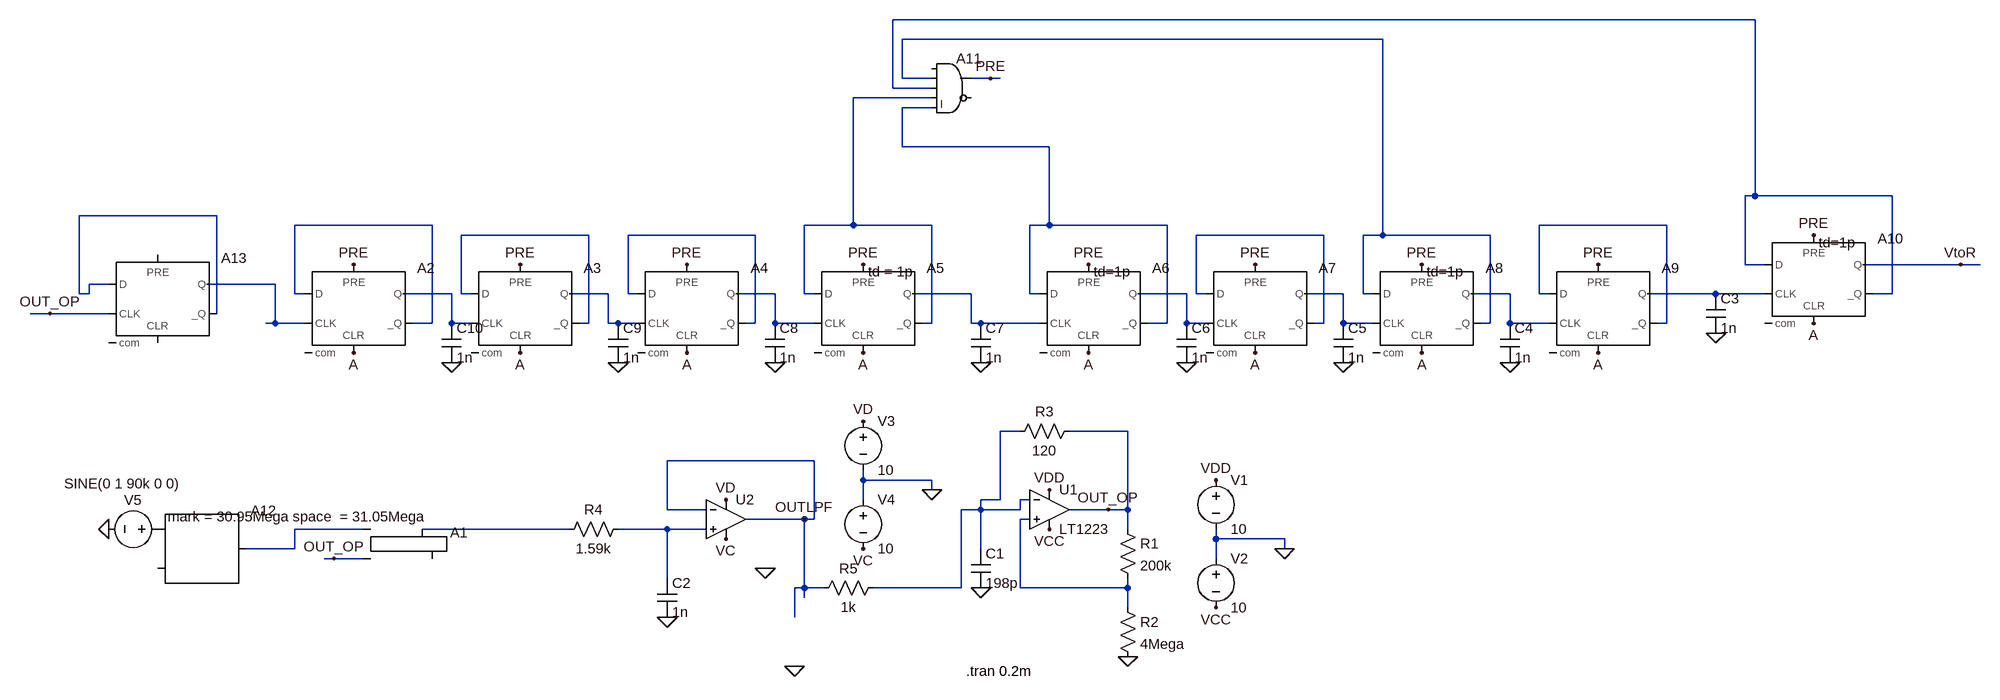
[diagram p0: schematic PLL-Yoav.asc]
PLL-Yoav.asc, the LTspice schematic file:
Version 4
SHEET 1 2084 812
WIRE 1328 -656 -80 -656
WIRE 720 -624 -64 -624
WIRE -64 -560 -64 -624
WIRE -16 -560 -64 -560
WIRE 80 -560 48 -560
WIRE 96 -560 80 -560
WIRE -80 -544 -80 -656
WIRE -16 -544 -80 -544
WIRE -16 -528 -144 -528
WIRE -16 -512 -64 -512
WIRE -64 -448 -64 -512
WIRE 176 -448 -64 -448
WIRE 1328 -368 1328 -656
WIRE 1328 -368 1312 -368
WIRE 1552 -368 1328 -368
WIRE -1184 -336 -1408 -336
WIRE -832 -320 -1056 -320
WIRE -144 -320 -144 -528
WIRE -144 -320 -224 -320
WIRE -16 -320 -144 -320
WIRE 176 -320 176 -448
WIRE 176 -320 144 -320
WIRE 368 -320 176 -320
WIRE 1184 -320 976 -320
WIRE -576 -304 -784 -304
WIRE -304 -304 -512 -304
WIRE 624 -304 416 -304
WIRE 720 -304 720 -624
WIRE 720 -304 688 -304
WIRE 896 -304 720 -304
WIRE 1312 -256 1312 -368
WIRE 1344 -256 1312 -256
WIRE 1664 -256 1504 -256
WIRE 1696 -256 1664 -256
WIRE -1360 -224 -1392 -224
WIRE -1088 -224 -1200 -224
WIRE -1408 -208 -1408 -336
WIRE -1392 -208 -1392 -224
WIRE -1392 -208 -1408 -208
WIRE -1056 -208 -1056 -320
WIRE -1040 -208 -1056 -208
WIRE -800 -208 -880 -208
WIRE -784 -208 -784 -304
WIRE -768 -208 -784 -208
WIRE -544 -208 -608 -208
WIRE -512 -208 -512 -304
WIRE -496 -208 -512 -208
WIRE -272 -208 -336 -208
WIRE -224 -208 -224 -320
WIRE -208 -208 -224 -208
WIRE 48 -208 -48 -208
WIRE 144 -208 144 -320
WIRE 160 -208 144 -208
WIRE 400 -208 320 -208
WIRE 416 -208 416 -304
WIRE 432 -208 416 -208
WIRE 656 -208 592 -208
WIRE 688 -208 688 -304
WIRE 704 -208 688 -208
WIRE 928 -208 864 -208
WIRE 976 -208 976 -320
WIRE 992 -208 976 -208
WIRE 1264 -208 1152 -208
WIRE 1344 -208 1264 -208
WIRE 1552 -208 1552 -368
WIRE 1552 -208 1520 -208
WIRE -1456 -176 -1488 -176
WIRE -1360 -176 -1456 -176
WIRE -1184 -176 -1184 -336
WIRE -1088 -160 -1088 -224
WIRE -1088 -160 -1104 -160
WIRE -1040 -160 -1088 -160
WIRE -832 -160 -832 -320
WIRE -832 -160 -864 -160
WIRE -800 -160 -800 -208
WIRE -768 -160 -800 -160
WIRE -576 -160 -576 -304
WIRE -576 -160 -592 -160
WIRE -544 -160 -544 -208
WIRE -528 -160 -544 -160
WIRE -496 -160 -528 -160
WIRE -304 -160 -304 -304
WIRE -304 -160 -320 -160
WIRE -272 -160 -272 -208
WIRE -208 -160 -272 -160
WIRE -16 -160 -16 -320
WIRE -16 -160 -32 -160
WIRE 48 -160 48 -208
WIRE 64 -160 48 -160
WIRE 160 -160 64 -160
WIRE 368 -160 368 -320
WIRE 368 -160 336 -160
WIRE 400 -160 400 -208
WIRE 432 -160 400 -160
WIRE 624 -160 624 -304
WIRE 624 -160 608 -160
WIRE 656 -160 656 -208
WIRE 704 -160 656 -160
WIRE 896 -160 896 -304
WIRE 896 -160 880 -160
WIRE 928 -160 928 -208
WIRE 992 -160 928 -160
WIRE 1184 -160 1184 -320
WIRE 1184 -160 1168 -160
WIRE 128 16 96 16
WIRE 304 16 208 16
WIRE -208 64 -448 64
WIRE -128 96 -128 80
WIRE -16 96 -128 96
WIRE -16 112 -16 96
WIRE -128 128 -128 96
WIRE 96 128 96 16
WIRE 96 128 64 128
WIRE 144 128 128 128
WIRE -448 144 -448 64
WIRE -384 144 -448 144
WIRE 64 144 64 128
WIRE 64 144 32 144
WIRE 128 144 128 128
WIRE 128 144 64 144
WIRE 272 144 208 144
WIRE 304 144 304 16
WIRE 304 144 272 144
WIRE -224 160 -320 160
WIRE -208 160 -208 64
WIRE -208 160 -224 160
WIRE 144 160 128 160
WIRE -944 176 -1056 176
WIRE -608 176 -848 176
WIRE -448 176 -528 176
WIRE -384 176 -448 176
WIRE 304 176 304 144
WIRE 448 192 448 176
WIRE 560 192 448 192
WIRE -1056 208 -1056 176
WIRE -1056 208 -1136 208
WIRE 64 208 64 144
WIRE 560 208 560 192
WIRE -992 224 -1008 224
WIRE -944 224 -992 224
WIRE 448 224 448 192
WIRE -448 256 -448 176
WIRE -224 272 -224 160
WIRE -224 272 -240 272
WIRE -192 272 -224 272
WIRE 32 272 32 144
WIRE 32 272 -112 272
WIRE 128 272 128 160
WIRE 304 272 304 256
WIRE 304 272 128 272
WIRE -224 288 -224 272
WIRE 304 304 304 272
WIRE -240 320 -240 272
FLAG 64 272 0
FLAG 560 208 0
FLAG 448 96 VDD
FLAG 448 304 VCC
FLAG 176 112 VDD
FLAG 176 176 VCC
FLAG 272 144 OUT_OP
FLAG -16 112 0
FLAG -128 0 VD
FLAG -128 208 VC
FLAG -448 320 0
FLAG -352 128 VD
FLAG -352 192 VC
FLAG -224 160 OUTLPF
FLAG -1360 176 0
FLAG 1264 -144 0
FLAG 1664 -256 VtoR
FLAG 1424 -304 PRE
FLAG 1072 -256 PRE
FLAG 784 -256 PRE
FLAG 512 -256 PRE
FLAG 240 -256 PRE
FLAG -128 -256 PRE
FLAG -416 -256 PRE
FLAG -688 -256 PRE
FLAG -960 -256 PRE
FLAG 1424 -160 A
FLAG 1072 -112 A
FLAG 784 -112 A
FLAG 512 -112 A
FLAG 240 -112 A
FLAG -128 -112 A
FLAG -416 -112 A
FLAG -688 -112 A
FLAG -960 -112 A
FLAG 928 -96 0
FLAG -800 -96 0
FLAG -528 -96 0
FLAG -272 -96 0
FLAG 64 -96 0
FLAG 400 -96 0
FLAG 656 -96 0
FLAG 80 -560 PRE
FLAG -1456 -176 OUT_OP
FLAG -240 400 0
FLAG 304 384 0
FLAG -992 224 OUT_OP
FLAG -288 240 0
DATAFLAG 1680 -272 ""
SYMBOL res 288 160 R0
SYMATTR InstName R1
SYMATTR Value 200k
SYMBOL res 288 288 R0
SYMATTR InstName R2
SYMATTR Value 4Mega
SYMBOL res 224 0 R90
WINDOW 0 0 56 VBottom 2
WINDOW 3 32 56 VTop 2
SYMATTR InstName R3
SYMATTR Value 120
SYMBOL cap 48 208 R0
SYMATTR InstName C1
SYMATTR Value 198p
SYMBOL voltage 448 80 R0
WINDOW 123 0 0 Left 0
WINDOW 39 0 0 Left 0
SYMATTR InstName V1
SYMATTR Value 10
SYMBOL voltage 448 208 R0
WINDOW 123 0 0 Left 0
WINDOW 39 0 0 Left 0
SYMATTR InstName V2
SYMATTR Value 10
SYMBOL voltage -128 -16 R0
SYMATTR InstName V3
SYMATTR Value 10
SYMBOL voltage -128 112 R0
SYMATTR InstName V4
SYMATTR Value 10
SYMBOL OpAmps\\UniversalOpAmp2 -352 160 R0
SYMATTR InstName U2
SYMBOL res -512 160 R90
WINDOW 0 0 56 VBottom 2
WINDOW 3 32 56 VTop 2
SYMATTR InstName R4
SYMATTR Value 1.59k
SYMBOL cap -464 256 R0
SYMATTR InstName C2
SYMATTR Value 1n
SYMBOL Digital\\srflop -896 128 R0
SYMATTR InstName A1
SYMBOL voltage -1264 176 R90
WINDOW 0 -32 56 VBottom 2
WINDOW 3 -90 73 VTop 2
WINDOW 123 0 0 Left 0
WINDOW 39 0 0 Left 0
SYMATTR InstName V5
SYMATTR Value SINE(0 1 90k 0 0)
SYMBOL Digital\\dflop -960 -256 R0
SYMATTR InstName A2
SYMBOL Digital\\dflop -688 -256 R0
SYMATTR InstName A3
SYMBOL Digital\\dflop -416 -256 R0
SYMATTR InstName A4
SYMBOL Digital\\dflop -128 -256 R0
WINDOW 3 8 12 Left 2
SYMATTR Value td = 1p
SYMATTR InstName A5
SYMBOL Digital\\dflop 240 -256 R0
WINDOW 3 8 12 Left 2
SYMATTR Value td=1p
SYMATTR InstName A6
SYMBOL Digital\\dflop 512 -256 R0
SYMATTR InstName A7
SYMBOL Digital\\dflop 784 -256 R0
WINDOW 3 8 12 Left 2
SYMATTR Value td=1p
SYMATTR InstName A8
SYMBOL Digital\\dflop 1072 -256 R0
SYMATTR InstName A9
SYMBOL Digital\\dflop 1424 -304 R0
WINDOW 3 8 12 Left 2
SYMATTR Value td=1p
SYMATTR InstName A10
SYMBOL cap 1248 -208 R0
SYMATTR InstName C3
SYMATTR Value 1n
SYMBOL Digital\\and 16 -608 R0
SYMATTR InstName A11
SYMBOL cap 912 -160 R0
SYMATTR InstName C4
SYMATTR Value 1n
SYMBOL cap 640 -160 R0
SYMATTR InstName C5
SYMATTR Value 1n
SYMBOL cap 384 -160 R0
SYMATTR InstName C6
SYMATTR Value 1n
SYMBOL cap 48 -160 R0
SYMATTR InstName C7
SYMATTR Value 1n
SYMBOL cap -288 -160 R0
SYMATTR InstName C8
SYMATTR Value 1n
SYMBOL cap -544 -160 R0
SYMATTR InstName C9
SYMATTR Value 1n
SYMBOL cap -816 -160 R0
SYMATTR InstName C10
SYMATTR Value 1n
SYMBOL SpecialFunctions\\modulate -1280 176 R0
WINDOW 3 16 -20 Left 2
SYMATTR Value mark = 30.95Mega space  = 31.05Mega
SYMATTR InstName A12
SYMBOL Digital\\dflop -1280 -272 R0
SYMATTR InstName A13
SYMBOL OpAmps\\LT1223 176 80 R0
SYMATTR InstName U1
SYMBOL res -96 256 R90
WINDOW 0 0 56 VBottom 2
WINDOW 3 32 56 VTop 2
SYMATTR InstName R5
SYMATTR Value 1k
TEXT 40 408 Left 2 !.tran 0.2m

The netlist it stands for:
* PLL-Yoav.asc
R1 OUT_OP N021 200k
R2 N021 0 4Mega
R3 OUT_OP N020 120
C1 N020 0 198p
V1 VDD 0 10
V2 0 VCC 10
V3 VD 0 10
V4 0 VC 10
XU2 N024 OUTLPF VD VC OUTLPF level2 Avol=1Meg GBW=10Meg Slew=10Meg Ilimit=25m Rail=0 Vos=0 En=0 Enk=0 In=0 Ink=0 Rin=500Meg  ; pins In+ In- V+ V- OUT
R4 N024 N023 1.59k
C2 N024 0 1n
A1 N022 OUT_OP 0 0 0 0 N023 0 SRFLOP
V5 P001 0 SINE(0 1 90k 0 0)
A2 N006 0 N011 PRE A N006 N012 0 DFLOP
A3 N008 0 N012 PRE A N008 N013 0 DFLOP
A4 N009 0 N013 PRE A N009 N014 0 DFLOP
A5 N003 0 N014 PRE A N003 N015 0 DFLOP td = 1p
A6 N004 0 N015 PRE A N004 N016 0 DFLOP td=1p
A7 N010 0 N016 PRE A N010 N017 0 DFLOP
A8 N002 0 N017 PRE A N002 N018 0 DFLOP td=1p
A9 N007 0 N018 PRE A N007 N019 0 DFLOP
A10 N001 0 N019 PRE A N001 VtoR 0 DFLOP td=1p
C3 N019 0 1n
A11 0 N002 N001 N003 N004 0 PRE 0 AND
C4 N018 0 1n
C5 N017 0 1n
C6 N016 0 1n
C7 N015 0 1n
C8 N014 0 1n
C9 N013 0 1n
C10 N012 0 1n
A12 P001 0 0 0 0 0 N022 0 MODULATOR mark = 30.95Mega space  = 31.05Mega
A13 N005 0 OUT_OP 0 0 N005 N011 0 DFLOP
XU1 N021 N020 VDD VCC OUT_OP LT1223  ; pins In+ In- V+ V- OUT
R5 N020 OUTLPF 1k
.tran 0.2m
.lib UniversalOpAmp2.lib
.backanno
.end